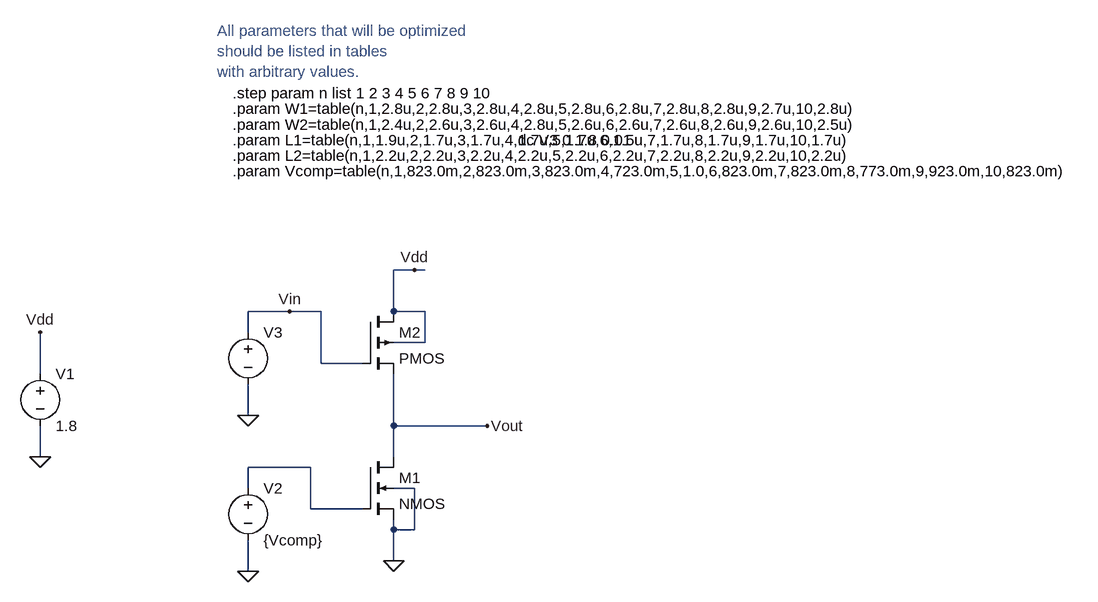
[diagram p0: schematic comparator_1.asc]
comparator_1.asc, the LTspice schematic file:
Version 4
SHEET 1 4496 2148
WIRE -80 -480 -112 -480
WIRE -64 -480 -80 -480
WIRE -272 -416 -336 -416
WIRE -224 -416 -272 -416
WIRE -112 -416 -112 -480
WIRE -64 -416 -112 -416
WIRE -336 -384 -336 -416
WIRE -64 -368 -64 -416
WIRE -64 -368 -112 -368
WIRE -224 -336 -224 -416
WIRE -160 -336 -224 -336
WIRE -656 -320 -656 -384
WIRE -336 -256 -336 -304
WIRE -112 -240 -112 -320
WIRE 32 -240 -112 -240
WIRE -656 -192 -656 -240
WIRE -112 -192 -112 -240
WIRE -240 -176 -336 -176
WIRE -336 -144 -336 -176
WIRE -80 -144 -112 -144
WIRE -240 -112 -240 -176
WIRE -160 -112 -240 -112
WIRE -112 -80 -112 -96
WIRE -80 -80 -80 -144
WIRE -80 -80 -112 -80
WIRE -112 -32 -112 -80
WIRE -336 -16 -336 -64
FLAG -656 -192 0
FLAG -80 -480 Vdd
FLAG -656 -384 Vdd
FLAG -112 -32 0
FLAG -336 -16 0
FLAG -336 -256 0
FLAG -272 -416 Vin
FLAG 32 -240 Vout
SYMBOL nmos4 -160 -192 R0
SYMATTR InstName M1
SYMATTR Value2 l={L1} w={W1} ad={W1*L1} as={W1*L1} pd={2*W1+2*L1} ps={2*W1+2*L1} m=1
SYMBOL pmos4 -160 -416 R0
SYMATTR InstName M2
SYMATTR Value2 l={L2} w={W2} ad={W2*L2} as={W2*L2} pd={2*W1+2*L1} ps={2*W1+2*L1} m=1
SYMBOL voltage -656 -336 R0
WINDOW 123 0 0 Left 0
WINDOW 39 0 0 Left 0
SYMATTR InstName V1
SYMATTR Value 1.8
SYMBOL voltage -336 -160 R0
WINDOW 123 0 0 Left 0
WINDOW 39 0 0 Left 0
SYMATTR InstName V2
SYMATTR Value {Vcomp}
SYMBOL voltage -336 -400 R0
WINDOW 123 0 0 Left 0
WINDOW 39 0 0 Left 0
SYMATTR InstName V3
SYMATTR Value ""
TEXT -360 -752 Left 2 !.step param n list 1 2 3 4 5 6 7 8 9 10 
TEXT -360 -728 Left 2 !.param W1=table(n,1,2.8u,2,2.8u,3,2.8u,4,2.8u,5,2.8u,6,2.8u,7,2.8u,8,2.8u,9,2.7u,10,2.8u)
TEXT -360 -704 Left 2 !.param W2=table(n,1,2.4u,2,2.6u,3,2.6u,4,2.8u,5,2.6u,6,2.6u,7,2.6u,8,2.6u,9,2.6u,10,2.5u)
TEXT -360 -632 Left 2 !.param Vcomp=table(n,1,823.0m,2,823.0m,3,823.0m,4,723.0m,5,1.0,6,823.0m,7,823.0m,8,773.0m,9,923.0m,10,823.0m)
TEXT -360 -680 Left 2 !.param L1=table(n,1,1.9u,2,1.7u,3,1.7u,4,1.7u,5,1.7u,6,1.5u,7,1.7u,8,1.7u,9,1.7u,10,1.7u)
TEXT -360 -656 Left 2 !.param L2=table(n,1,2.2u,2,2.2u,3,2.2u,4,2.2u,5,2.2u,6,2.2u,7,2.2u,8,2.2u,9,2.2u,10,2.2u)
TEXT 72 -680 Left 2 !.dc V3 0 1.8 0.01
TEXT -384 -848 Left 2 ;All parameters that will be optimized\nshould be listed in tables\nwith arbitrary values.

The netlist it stands for:
* comparator_1.asc
M1 Vout N001 0 0 NMOS l={L1} w={W1} ad={W1*L1} as={W1*L1} pd={2*W1+2*L1} ps={2*W1+2*L1} m=1
M2 Vdd Vin Vout Vdd PMOS l={L2} w={W2} ad={W2*L2} as={W2*L2} pd={2*W1+2*L1} ps={2*W1+2*L1} m=1
V1 Vdd 0 1.8
V2 N001 0 {Vcomp}
V3 Vin 0
.model NMOS NMOS
.model PMOS PMOS
.lib standard.mos
.step param n list 1 2 3 4 5 6 7 8 9 10
.param W1=table(n,1,2.8u,2,2.8u,3,2.8u,4,2.8u,5,2.8u,6,2.8u,7,2.8u,8,2.8u,9,2.7u,10,2.8u)
.param W2=table(n,1,2.4u,2,2.6u,3,2.6u,4,2.8u,5,2.6u,6,2.6u,7,2.6u,8,2.6u,9,2.6u,10,2.5u)
.param Vcomp=table(n,1,823.0m,2,823.0m,3,823.0m,4,723.0m,5,1.0,6,823.0m,7,823.0m,8,773.0m,9,923.0m,10,823.0m)
.param L1=table(n,1,1.9u,2,1.7u,3,1.7u,4,1.7u,5,1.7u,6,1.5u,7,1.7u,8,1.7u,9,1.7u,10,1.7u)
.param L2=table(n,1,2.2u,2,2.2u,3,2.2u,4,2.2u,5,2.2u,6,2.2u,7,2.2u,8,2.2u,9,2.2u,10,2.2u)
.dc V3 0 1.8 0.01
* All parameters that will be optimized
* should be listed in tables
* with arbitrary values.
.backanno
.end

* Results of the author's LTspice run, read from the files saved beside the schematic
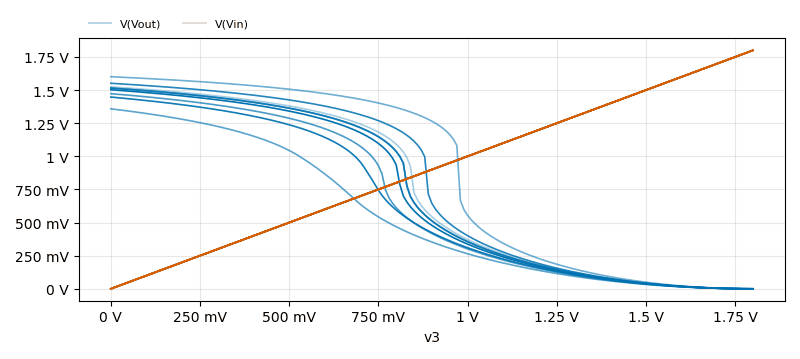
[diagram p1: DC transfer characteristic of comparator_1.asc, plotted from the saved traces]
* DC transfer characteristic, 10 runs:
*   V(Vout) [n=1]: 1.525 V at v3=0 V, 143.9 nV at v3=1.8 V, min 143.9 nV, max 1.525 V
*   V(Vout) [n=2]: 1.515 V at v3=0 V, 128.5 nV at v3=1.8 V, min 128.5 nV, max 1.515 V
*   V(Vout) [n=3]: 1.515 V at v3=0 V, 128.5 nV at v3=1.8 V, min 128.5 nV, max 1.515 V
*   V(Vout) [n=4]: 1.601 V at v3=0 V, 143.7 nV at v3=1.8 V, min 143.7 nV, max 1.601 V
*   V(Vout) [n=5]: 1.359 V at v3=0 V, 107 nV at v3=1.8 V, min 107 nV, max 1.359 V
*   V(Vout) [n=6]: 1.473 V at v3=0 V, 113.9 nV at v3=1.8 V, min 113.9 nV, max 1.473 V
*   V(Vout) [n=7]: 1.515 V at v3=0 V, 128.5 nV at v3=1.8 V, min 128.5 nV, max 1.515 V
*   V(Vout) [n=8]: 1.552 V at v3=0 V, 136.2 nV at v3=1.8 V, min 136.2 nV, max 1.552 V
*   V(Vin) [n=1]: 0 V at v3=0 V, 1.8 V at v3=1.8 V, min 0 V, max 1.8 V
*   V(Vin) [n=2]: 0 V at v3=0 V, 1.8 V at v3=1.8 V, min 0 V, max 1.8 V
*   V(Vin) [n=3]: 0 V at v3=0 V, 1.8 V at v3=1.8 V, min 0 V, max 1.8 V
*   V(Vin) [n=4]: 0 V at v3=0 V, 1.8 V at v3=1.8 V, min 0 V, max 1.8 V
*   V(Vin) [n=5]: 0 V at v3=0 V, 1.8 V at v3=1.8 V, min 0 V, max 1.8 V
*   V(Vin) [n=6]: 0 V at v3=0 V, 1.8 V at v3=1.8 V, min 0 V, max 1.8 V
*   V(Vin) [n=7]: 0 V at v3=0 V, 1.8 V at v3=1.8 V, min 0 V, max 1.8 V
*   V(Vin) [n=8]: 0 V at v3=0 V, 1.8 V at v3=1.8 V, min 0 V, max 1.8 V